# EAGLE schematic untitled (EAGLE 8.7.0)
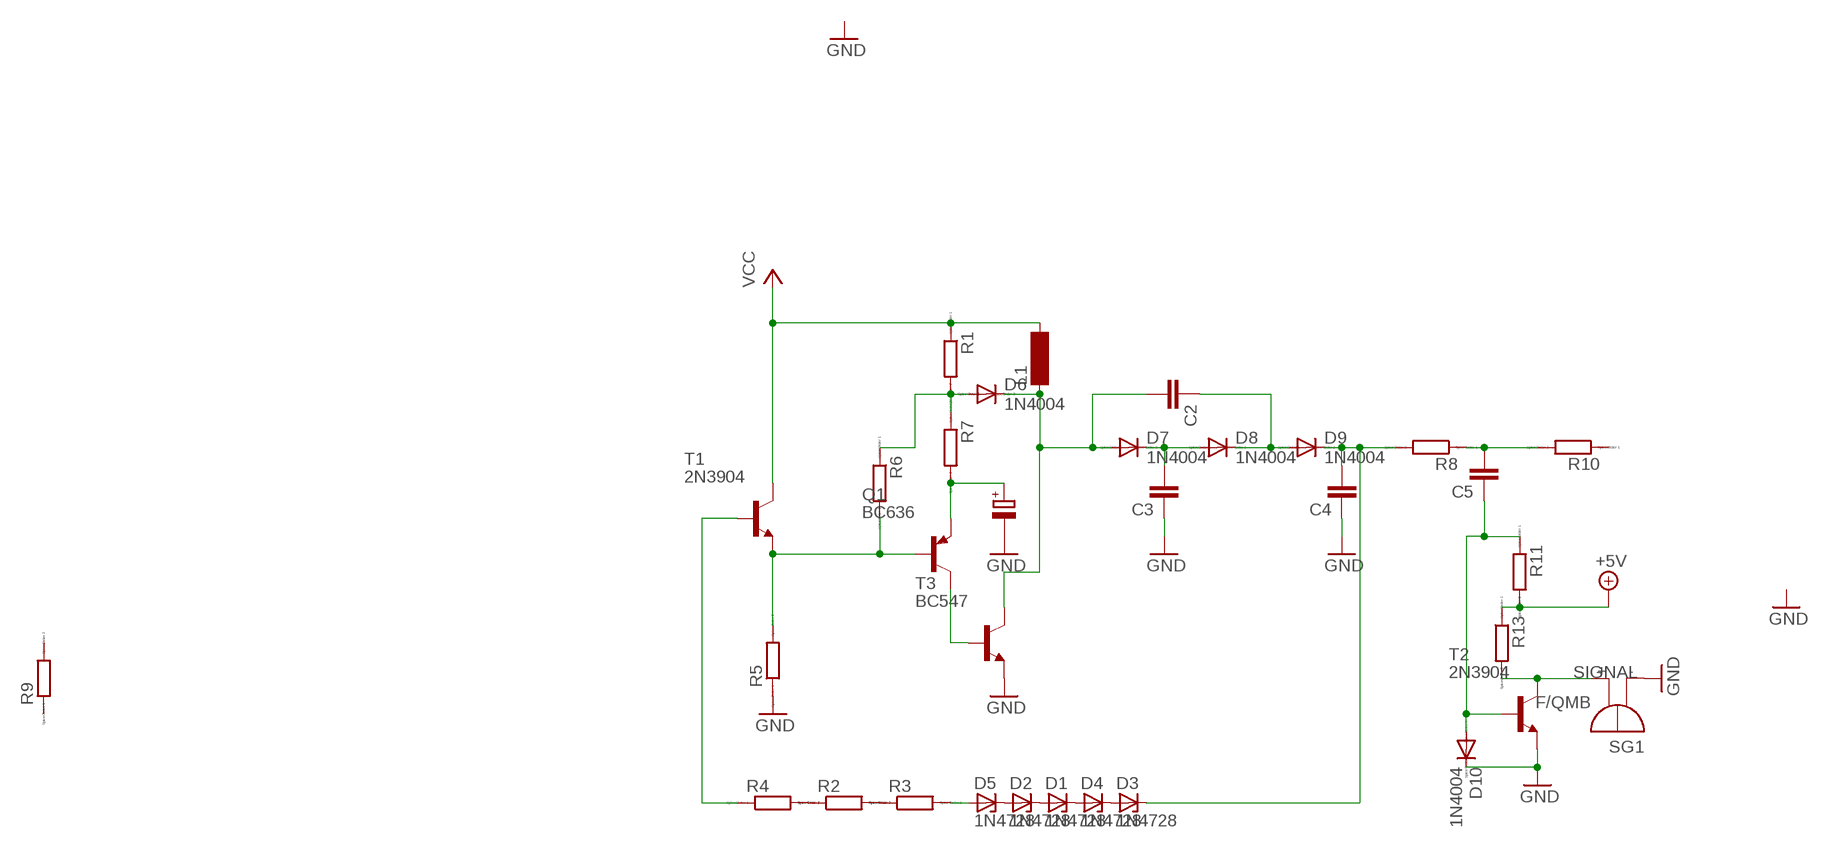
[diagram p0: schematic, sheet 1]

## Parts
C2  C5/7.2  [C5B7.2]
C3  C5/7.2  [C5B7.2]
C4  C5/7.2  [C5B7.2]
C5  C5/7.2  [C5B7.2]
D1  1N4728  [DO41Z10]
D2  1N4728  [DO41Z10]
D3  1N4728  [DO41Z10]
D4  1N4728  [DO41Z10]
D5  1N4728  [DO41Z10]
D6  1N4004  [DO41-10]
D7  1N4004  [DO41-10]
D8  1N4004  [DO41-10]
D9  1N4004  [DO41-10]
D10  1N4004  [DO41-10]
L1  SD8  [SD8]
Q1  BC636  [TO92-BCE]
R1  R  [R0805]
R2  R  [R0805]
R3  R  [R0805]
R4  R  [R0805]
R5  R  [R0805]
R6  R  [R0805]
R7  R  [R0805]
R8  R  [R0805]
R9  R  [R0805]
R10  R  [R0805]
R11  R  [R0805]
R13  R  [R0805]
SG1  F/QMB  [F/QMB]
T1  2N3904  [TO92]
T2  2N3904  [TO92]
T3  BC547  [TO92]

## Nets
+5V: R11.2 R13.1
GND: C3.1 C4.1 D10.C R5.1 SG1.-(+) T2.3(E)
N$1: R2.2 R3.1
N$2: R2.1 R4.2
N$3: D5.A R3.2
N$4: R5.2 R6.2 T1.3(E)
N$5: R4.1 T1.2(B)
N$6: D1.A D2.C
N$7: D1.C D4.A
N$8: D2.A D5.C
N$9: D3.A D4.C
N$10: Q1.E R7.2
N$11: D6.A R1.2 R6.1 R7.1
N$12: C2.2 D6.C L1.1 T3.3(C)
N$13: Q1.C T3.2(B)
N$14: C3.2 D7.C D8.A
N$15: C2.1 D8.C D9.A
N$16: C4.2 D3.C D9.C R8.2
N$17: C5.2 R8.1 R10.2
N$18: C5.1 D10.A R11.1 T2.2(B)
SIGNAL: R13.2 SG1.+(-) T2.1(C)
VCC: L1.2 R1.1 T1.1(C)
Unconnected: D7.A Q1.B R9.1 R9.2 R10.1 T3.1(E)

## Library data of the parts
C2-C5 = capacitor-wima:C: CAPACITOR naming: grid - package width
D1-D5 = diode:1N4728: Z DIODE 3.3 V, 1W, 5 percent
D6-D10 = diode:1N4004: DIODE general purpose rectifier, 1 A
L1 = inductor-neosid:SD8: INDUCTOR nominal inductance; OC_FARNELL: unknown; OC_NEWARK: unknown
Q1 = transistor-pnp:BC636*: PNP Transistror
R1-R11 R13 = eagle-ltspice:R: RESISTOR, European symbol; SPICEMODEL: NONE; SPICEPREFIX: R
SG1 = buzzer:F/QMB: BUZZER Source: Buerklin; OC_FARNELL: unknown; OC_NEWARK: unknown
T1 T2 = transistor:2N3904: NPN TRANSISTOR
T3 = transistor-neu-to92:BC547: NPN TRANSISTOR